# EAGLE design Stopwatch (EAGLE 9.5.2)
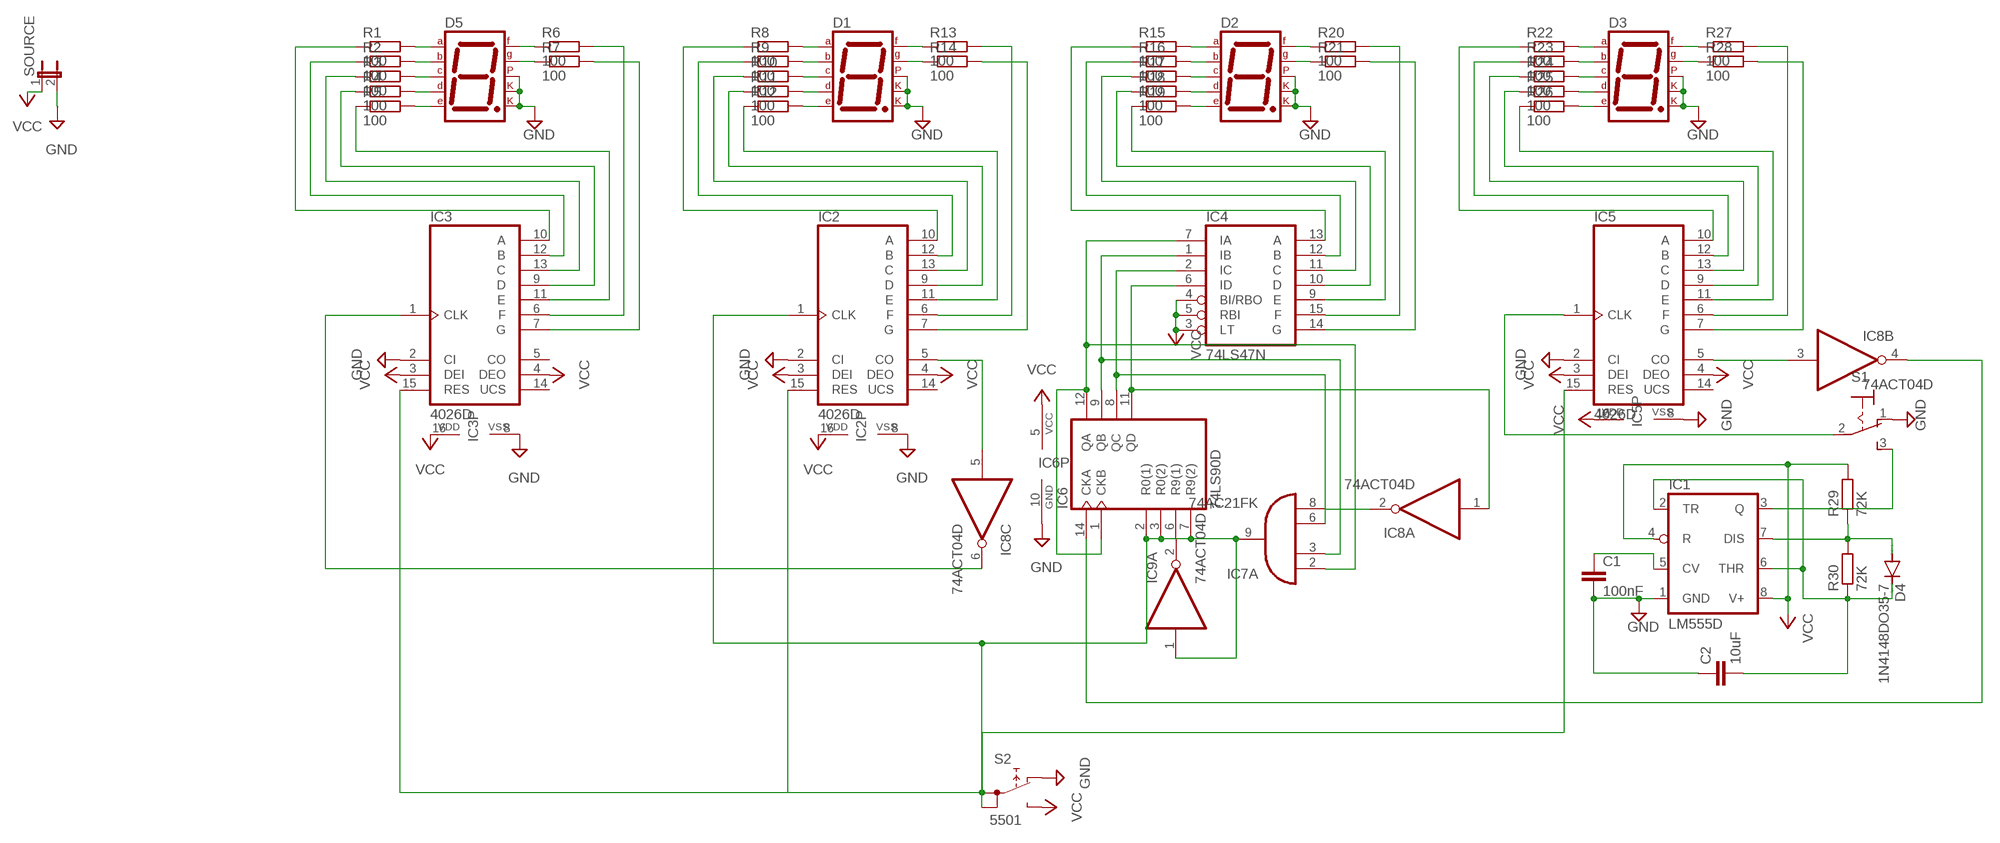
[diagram p0: schematic, sheet 1]

## Parts
C1  100nF  C2.5/2  [C2.5-2]
C2  10uF  C2.5/2  [C2.5-2]
D1  7SEG-CK  [7SEG-13]
D2  7SEG-CK  [7SEG-13]
D3  7SEG-CK  [7SEG-13]
D4  1N4148DO35-7  [DO35-7]
D5  7SEG-CK  [7SEG-13]
IC1  LM555D  [SO08]
IC2  4026D  [SO16]
IC3  4026D  [SO16]
IC4  74LS47N  [DIL16]
IC5  4026D  [SO16]
IC6  74LS90D  [SO14]
IC7  74AC21FK  [LCC20]
IC8  74ACT04D  [SO14]
IC9  74ACT04D  [SO14]
R1  100  R-EU_R0805  [R0805]
R2  100  R-EU_R0805  [R0805]
R3  100  R-EU_R0805  [R0805]
R4  100  R-EU_R0805  [R0805]
R5  100  R-EU_R0805  [R0805]
R6  100  R-EU_R0805  [R0805]
R7  100  R-EU_R0805  [R0805]
R8  100  R-EU_R0805  [R0805]
R9  100  R-EU_R0805  [R0805]
R10  100  R-EU_R0805  [R0805]
R11  100  R-EU_R0805  [R0805]
R12  100  R-EU_R0805  [R0805]
R13  100  R-EU_R0805  [R0805]
R14  100  R-EU_R0805  [R0805]
R15  100  R-EU_R0805  [R0805]
R16  100  R-EU_R0805  [R0805]
R17  100  R-EU_R0805  [R0805]
R18  100  R-EU_R0805  [R0805]
R19  100  R-EU_R0805  [R0805]
R20  100  R-EU_R0805  [R0805]
R21  100  R-EU_R0805  [R0805]
R22  100  R-EU_R0805  [R0805]
R23  100  R-EU_R0805  [R0805]
R24  100  R-EU_R0805  [R0805]
R25  100  R-EU_R0805  [R0805]
R26  100  R-EU_R0805  [R0805]
R27  100  R-EU_R0805  [R0805]
R28  100  R-EU_R0805  [R0805]
R29  72K  R-EU_R0805  [R0805]
R30  72K  R-EU_R0805  [R0805]
S1  320-916  [320-916]
S2  5501  [5501]
SOURCE  JP1E  [JP1]

## Nets
GND: C1.2 C2.1 D1.3(CK1) D1.5(DP) D1.8(CK2) D2.3(CK1) D2.5(DP) D2.8(CK2) D3.3(CK1) D3.5(DP) D3.8(CK2) D5.3(CK1) D5.5(DP) D5.8(CK2) IC1.1(GND) IC2.2(CI) IC2.8(VSS) IC3.2(CI) IC3.8(VSS) IC5.2(CI) IC5.8(VSS) IC6.10(GND) S1.1(O) S2.NC SOURCE.2
N$1: IC2.10(A) R8.1
N$2: IC2.12(B) R9.1
N$3: IC3.10(A) R1.1
N$4: IC3.12(B) R2.1
N$5: IC3.13(C) R3.1
N$6: IC3.9(D) R4.1
N$7: IC3.11(E) R5.1
N$8: IC3.6(F) R6.2
N$9: IC3.7(G) R7.2
N$10: D5.7(A) R1.2
N$11: D5.6(B) R2.2
N$12: D5.4(C) R3.2
N$13: D5.2(D) R4.2
N$14: D5.1(E) R5.2
N$15: D5.9(F) R6.1
N$16: D5.10(G) R7.1
N$17: IC2.13(C) R10.1
N$18: IC2.9(D) R11.1
N$19: IC2.11(E) R12.1
N$20: IC2.6(F) R13.2
N$21: IC2.7(G) R14.2
N$22: D1.7(A) R8.2
N$23: D1.6(B) R9.2
N$24: D1.4(C) R10.2
N$25: D1.2(D) R11.2
N$26: D1.1(E) R12.2
N$27: D1.9(F) R13.1
N$28: D1.10(G) R14.1
N$29: IC4.13(A) R15.1
N$30: IC4.12(B) R16.1
N$31: IC4.11(C) R17.1
N$32: IC4.10(D) R18.1
N$33: IC4.9(E) R19.1
N$34: IC4.15(F) R20.2
N$35: IC4.14(G) R21.2
N$36: D2.7(A) R15.2
N$37: D2.6(B) R16.2
N$38: D2.4(C) R17.2
N$39: D2.2(D) R18.2
N$40: D2.1(E) R19.2
N$41: D2.9(F) R20.1
N$42: D2.10(G) R21.1
N$43: IC5.10(A) R22.1
N$44: IC5.12(B) R23.1
N$45: IC5.13(C) R24.1
N$46: IC5.9(D) R25.1
N$47: IC5.11(E) R26.1
N$48: IC5.6(F) R27.2
N$49: IC5.7(G) R28.2
N$50: D3.7(A) R22.2
N$51: D3.6(B) R23.2
N$52: D3.4(C) R24.2
N$53: D3.2(D) R25.2
N$54: D3.1(E) R26.2
N$55: D3.9(F) R27.1
N$56: D3.10(G) R28.1
N$57: C1.1 IC1.5(CV)
N$58: IC5.1(CLK) S1.2(P)
N$59: C2.2 D4.C IC1.2(TR) IC1.6(THR) R30.1
N$60: D4.A IC1.7(DIS) R29.1 R30.2
N$62: IC4.7(IA) IC6.1(CKB) IC6.12(QA) IC7.2(A:I0)
N$63: IC4.1(IB) IC6.9(QB) IC7.3(A:I1)
N$64: IC4.2(IC) IC6.8(QC) IC7.6(A:I2)
N$65: IC4.6(ID) IC6.11(QD) IC8.1(A:I)
N$66: IC7.8(A:I3) IC8.2(A:O)
N$67: IC5.5(CO) IC8.3(B:I)
N$68: IC6.14(CKA) IC8.4(B:O)
N$70: IC2.5(CO) IC8.5(C:I)
N$71: IC3.1(CLK) IC8.6(C:O)
N$72: IC1.3(Q) S1.3(S)
N$73: IC6.6(R9(1)) IC9.2(A:O)
N$74: IC2.1(CLK) IC2.15(RES) IC3.15(RES) IC5.15(RES) IC6.2(R0(1)) IC6.3(R0(2)) IC6.7(R9(2)) IC7.9(A:O) IC9.1(A:I) S2.1A S2.1B
VCC: IC1.4(R) IC1.8(V+) IC2.3(DEI) IC2.4(DEO) IC2.16(VDD) IC3.3(DEI) IC3.4(DEO) IC3.16(VDD) IC4.3(LT) IC4.4(BI/RBO) IC4.5(RBI) IC5.3(DEI) IC5.4(DEO) IC5.16(VDD) IC6.5(VCC) R29.2 S2.NO SOURCE.1
Unconnected: IC2.14(UCS) IC3.5(CO) IC3.14(UCS) IC5.14(UCS) IC7.12(B:O) IC7.13(B:I0) IC7.14(B:I1) IC7.18(B:I2) IC7.19(B:I3) IC8.8(D:O) IC8.9(D:I) IC8.10(E:O) IC8.11(E:I) IC8.12(F:O) IC8.13(F:I) IC9.3(B:I) IC9.4(B:O) IC9.5(C:I) IC9.6(C:O) IC9.8(D:O) IC9.9(D:I) IC9.10(E:O) IC9.11(E:I) IC9.12(F:O) IC9.13(F:I)

## Power pins joined to a net without a drawn wire
GND: IC4.8(GND) IC7.10(P:GND) IC8.7(P:GND) IC9.7(P:GND)
VCC: IC4.16(VCC) IC7.20(P:VCC) IC8.14(P:VCC) IC9.14(P:VCC)

## Library data of the parts
C1 C2 = capacitor-wima:C: CAPACITOR naming: grid - package width
D1-D3 D5 = special:7SEG-CK: 7-segment DISPLAY single cathode, 13 mm
D4 = diode:1N4148: DIODE high speed (Philips)
IC1 = linear:*555: TIMER
IC2 IC3 IC5 = 40xx:4026: Decade COUNTER/DIVIDER, 7-seg. outputs
IC4 = 74xx-eu:74*47: BCD to seven segment DECODER/DRIVER Source: http://www.ee.washington.edu/stores/DataSheets/74ls/74ls47.pdf
IC6 = 74xx-us:74*90: Decade, divide by twelve and binary COUNTER
IC7 = 74xx-eu:74*21: Dual 4-input AND gate
IC8 IC9 = 74xx-eu:74*04: Hex INVERTER
R1-R30 = rcl:R-EU_: RESISTOR, European symbol; SPICEPREFIX: R
S1 = switch:320-916: TOGGLE SWITCH distributor RS Components
S2 = switch:55?: PUSHBUTTON SERIES 5500 SWITCHES Source: www.e-switch.com .. 5500.pdf
SOURCE = jumper:JP1E: JUMPER

## Board
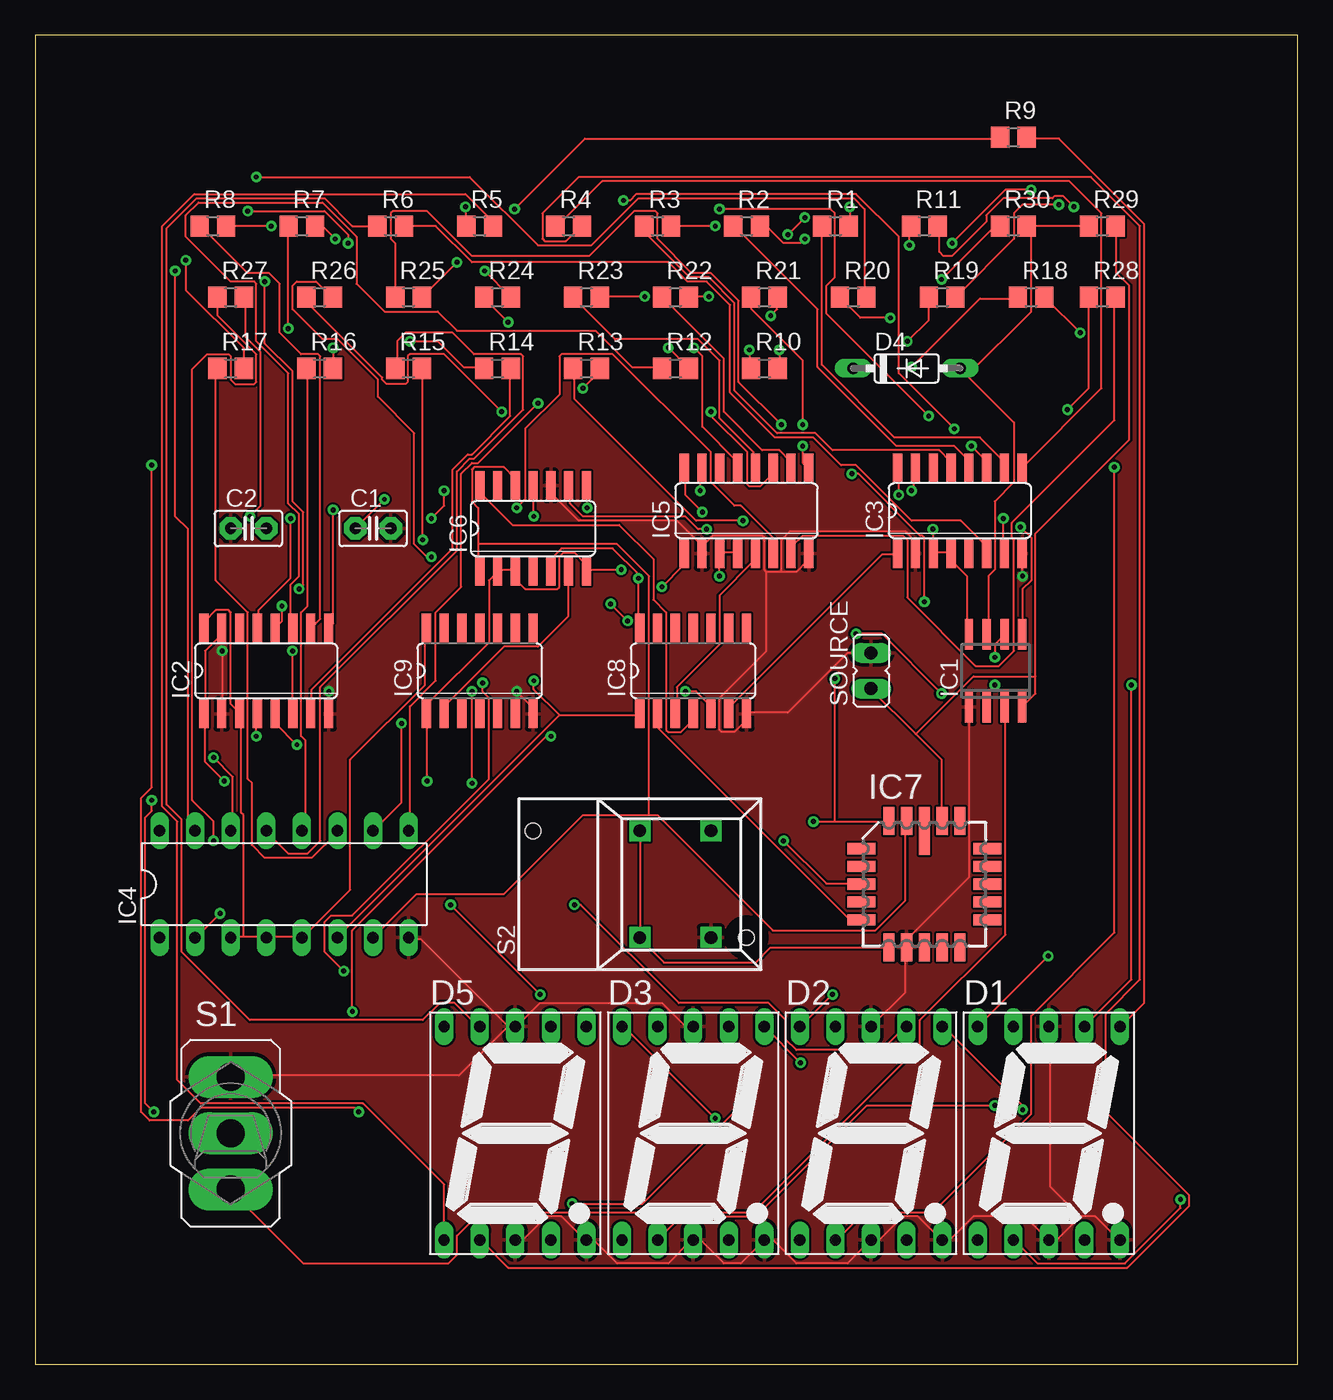
[diagram p1: board, top side]
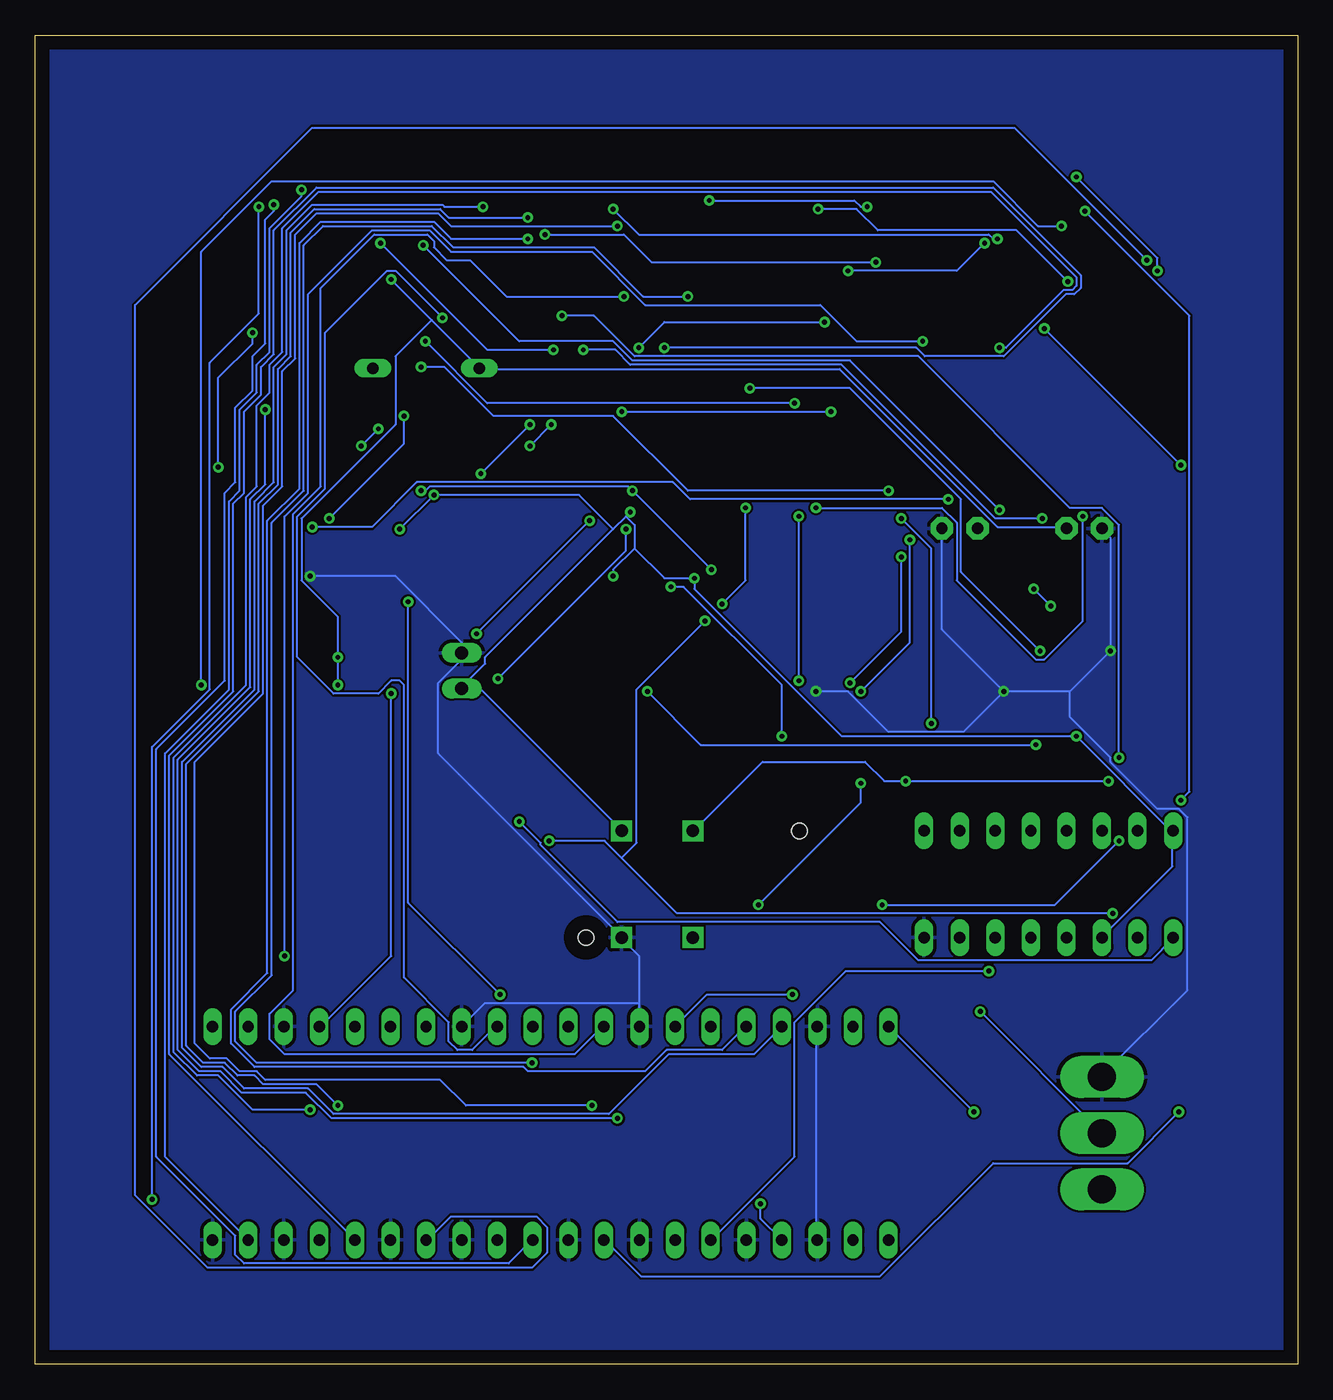
[diagram p2: board, bottom side, seen from below]

Size 90.15 x 94.92 mm. Coordinates in mm from the lower left corner, seen from the top.
Outline: 0,0 90.15,0 90.15,94.92 0,94.92 0,0
Copper layers (1*16): Top 0.035mm / dielectric 1.5mm / Bottom 0.035mm
Design rules "default": minimum track width 6mil, minimum drill 0.35mm, track to track 6mil, track to pad 6mil, pad to pad 6mil, via to via 6mil, smd to smd 6mil, copper to edge 40mil, drill to drill 6mil, minimum pad ring 10mil, minimum via ring 8mil, stop-mask expansion 4mil, vias tented up to drill 0mil, thermal gap 10mil

### Footprints (pad centres in the part's own frame; a part is rotated, then mirrored left to right if it is on the bottom)
C2.5-2 = drill 0.813 pad 1.6 octagon: 1 -1.27,0; 2 1.27,0
7SEG-13 = drill 0.813 long: 1 -5.08,-7.62; 2 -2.54,-7.62; 3 0,-7.62; 4 2.54,-7.62; 5 5.08,-7.62; 6 5.08,7.62; 7 2.54,7.62; 8 0,7.62; 9 -2.54,7.62; 10 -5.08,7.62
DO35-7 = drill 0.813 long: A 3.81,0; C -3.81,0
SO08 = smd 0.6 x 2.2: 1 -1.905,-2.6; 2 -0.635,-2.6; 3 0.635,-2.6; 4 1.905,-2.6; 5 1.905,2.6; 6 0.635,2.6; 7 -0.635,2.6; 8 -1.905,2.6
SO16 = smd 0.66 x 2.032: 1 -4.445,-3.073; 2 -3.175,-3.073; 3 -1.905,-3.073; 4 -0.635,-3.073; 5 0.635,-3.073; 6 1.905,-3.073; 7 3.175,-3.073; 8 4.445,-3.073; 9 4.445,3.073; 10 3.175,3.073; 11 1.905,3.073; 12 0.635,3.073; 13 -0.635,3.073; 14 -1.905,3.073; 15 -3.175,3.073; 16 -4.445,3.073
DIL16 = drill 0.813 long: 1 -8.89,-3.81; 2 -6.35,-3.81; 3 -3.81,-3.81; 4 -1.27,-3.81; 5 1.27,-3.81; 6 3.81,-3.81; 7 6.35,-3.81; 8 8.89,-3.81; 9 8.89,3.81; 10 6.35,3.81; 11 3.81,3.81; 12 1.27,3.81; 13 -1.27,3.81; 14 -3.81,3.81; 15 -6.35,3.81; 16 -8.89,3.81
SO14 = smd 0.66 x 2.032: 1 -3.81,-3.073; 2 -2.54,-3.073; 3 -1.27,-3.073; 4 0,-3.073; 5 1.27,-3.073; 6 2.54,-3.073; 7 3.81,-3.073; 8 3.81,3.073; 9 2.54,3.073; 10 1.27,3.073; 11 0,3.073; 12 -1.27,3.073; 13 -2.54,3.073; 14 -3.81,3.073
LCC20 = smd 0.8 x 3.4: 1 0,3.8 | smd 0.8 x 2: 2 -1.27,4.5; 3 -2.54,4.5; 9 -2.54,-4.5; 10 -1.27,-4.5; 11 0,-4.5; 12 1.27,-4.5; 13 2.54,-4.5; 19 2.54,4.5; 20 1.27,4.5 | smd 2 x 0.8: 4 -4.5,2.54; 5 -4.5,1.27; 6 -4.5,0; 7 -4.5,-1.27; 8 -4.5,-2.54; 14 4.5,-2.54; 15 4.5,-1.27; 16 4.5,0; 17 4.5,1.27; 18 4.5,2.54
R0805 = smd 1.3 x 1.5: 1 -0.95,0; 2 0.95,0
320-916 = drill 2.007 long: 1 0,4.013; 2 0,0; 3 0,-4.013
5501 = drill 0.9 pad 1.5 square: 1A 0,3.81; 1B 0,-3.81; NC 5.08,-3.81; NO 5.08,3.81 | hole 1.1: -7.62,3.81; 7.62,-3.81
JP1 = drill 0.914 long: 1 0,-1.27; 2 0,1.27

### Placement (x,y rotation side)
C1  24.13,59.69 0 top
C2  15.24,59.69 0 top
D1  72.39,16.51 0 top
D2  59.69,16.51 0 top
D3  46.99,16.51 0 top
D4  62.23,71.12 0 top
D5  34.29,16.51 0 top
IC1  68.58,49.53 0 top
IC2  16.51,49.53 0 top
IC3  66.04,60.96 0 top
IC4  17.78,34.29 0 top
IC5  50.8,60.96 0 top
IC6  35.56,59.69 0 top
IC7  63.5,34.29 0 top
IC8  46.99,49.53 0 top
IC9  31.75,49.53 0 top
R1  57.15,81.28 0 top
R2  50.8,81.28 0 top
R3  44.45,81.28 0 top
R4  38.1,81.28 0 top
R5  31.75,81.28 0 top
R6  25.4,81.28 0 top
R7  19.05,81.28 0 top
R8  12.7,81.28 0 top
R9  69.85,87.63 0 top
R10  52.07,71.12 0 top
R11  63.5,81.28 0 top
R12  45.72,71.12 0 top
R13  39.37,71.12 0 top
R14  33.02,71.12 0 top
R15  26.67,71.12 0 top
R16  20.32,71.12 0 top
R17  13.97,71.12 0 top
R18  71.12,76.2 0 top
R19  64.77,76.2 0 top
R20  58.42,76.2 0 top
R21  52.07,76.2 0 top
R22  45.72,76.2 0 top
R23  39.37,76.2 0 top
R24  33.02,76.2 0 top
R25  26.67,76.2 0 top
R26  20.32,76.2 0 top
R27  13.97,76.2 0 top
R28  76.2,76.2 0 top
R29  76.2,81.28 0 top
R30  69.85,81.28 0 top
S1  13.97,16.51 0 top
S2  43.18,34.29 0 top
SOURCE  59.69,49.53 0 top

### Tracks (layer width: path | path; a pad name or v marks a point on that pad's centre or on a via)
GND  (via drill 0.35)
  Top 0.152: D5.3 34.85,8.89 36.52,10.57 37.59,10.57 39.27,8.89 D5.5 39.88,8.89 41.55,7.21 45.21,7.21 46.89,8.89 D3.3 47.5,8.89 49.17,7.21 50.39,7.21 D3.5 52.68,8.89 54.36,7.21 58.01,7.21 D2.3 60.3,8.89 61.98,10.57 63.04,10.57 64.72,8.89 D2.5 65.33,8.89 67,10.57 70.66,10.57 72.34,8.89 D1.3 72.95,8.89 74.62,10.57 | 74.62,10.57 75.69,10.57 77.37,8.89 D1.5 | 74.62,10.57 72.49,12.7 72.49,24.13 D1.8 | 47.65,58.42 47.65,57.96 IC5.2 47.65,58.42 | 47.65,58.42 48.41,59.18 51.92,59.18 52.07,59.03 52.07,56.74 52.22,56.59 | 53.29,56.59 54.36,56.59 55.12,57.35 55.12,57.81 IC5.8 | 53.29,56.59 52.22,56.59 | 53.29,56.59 53.29,58.88 53.9,59.49 62.13,59.49 62.74,58.88 62.74,57.96 IC3.2 | IC6.10 36.83,62.23 38.81,60.25 45.82,60.25 47.65,58.42 | SOURCE.2 58.01,50.8 53.75,46.53 50.85,46.53 IC8.7 50.7,46.38 50.7,45.92 49.94,45.16 49.02,45.16 48.87,45.31 48.87,47.6 52.22,50.95 52.22,56.59 | v70.51,56.29 70.51,57.81 IC3.8 | D2.8 62.13,26.57 62.13,29.77 IC7.10 62.28,29.92 62.28,30.38 66.7,34.8 66.7,46.84 IC1.1 | v13.36,50.95 13.36,46.53 IC2.2 | v20.98,48.06 20.98,46.53 IC2.8 | v34.39,48.06 35.46,46.99 35.46,46.53 IC9.7 | 33.78,24.13 D5.8 | 33.78,24.13 27.53,30.38 26.77,30.38 IC4.8 | 33.78,24.13 30.28,20.62 13.97,20.62 S1.1 | 34.24,24.13 D5.8 | D3.8 46.43,24.13 44.76,25.81 36.07,25.81 34.39,24.13 D5.8
  Bottom 0.152: v70.51,56.29 64.41,56.29 59.69,51.56 SOURCE.2 59.69,50.34 61.37,48.67 61.37,43.64 48.26,30.53 S2.NC 48.26,30.38 47.04,29.16 47.04,25.81 | 47.04,25.81 47.04,24.13 D3.8 | 47.04,25.81 58.01,25.81 D2.8 | C2.1 13.97,59.64 13.36,59.03 v13.36,50.95 16.26,48.06 | 16.26,48.06 v20.98,48.06 | v34.39,48.06 32.11,48.06 29.21,45.16 23.88,45.16 v20.98,48.06 | C1.2 25.4,52.48 v20.98,48.06 | 16.26,48.06 16.26,46.23 13.36,43.33 13.36,43.03 10.01,39.67 8.48,39.67 7.87,39.06 7.87,26.72 13.97,20.62 S1.1 | D5.3 34.39,8.89 34.39,24.13 D5.8
  pour Top: 0,96.52 91.44,96.52 91.44,-1.27 0,-1.27
  pour Bottom: -1.27,97.79 91.44,97.79 92.71,97.79 92.71,-1.27 92.71,-2.54 -2.54,-2.54 -2.54,97.79
N$1
  Top 0.152: R8.1 11.84,81.28 15.19,77.93 16.71,77.93 17.48,77.16 17.48,73.66 19,72.14 20.22,72.14 20.37,71.98 20.37,53.24 19.76,52.63 IC2.10
N$2  (via drill 0.35)
  Top 0.152: v34.24,82.5 39.27,87.53 68.83,87.53 R9.1 | v16.41,77.32 16.41,72.9 18.39,70.92 18.39,61.62 19.15,60.86 19.15,55.68 v18.85,55.37 | v17.63,54.15 17.63,53.09 IC2.12
  Bottom 0.152: v34.24,82.5 31.5,82.5 29.97,80.97 20.07,80.97 v16.41,77.32 | v17.63,54.15 v18.85,55.37
N$3
  Top 0.152: R1.1 56.19,81.28 56.19,71.37 61.37,66.19 67.46,66.19 69.14,64.52 69.14,64.06 IC3.10
N$4
  Top 0.152: R2.1 49.94,81.28 55.88,75.34 55.88,71.22 61.52,65.58 65.63,65.58 66.55,64.67 66.55,64.06 IC3.12
N$5
  Top 0.152: R3.1 43.54,81.28 43.54,80.82 46.74,77.62 48.11,77.62 49.94,75.79 49.94,69.55 52.98,66.5 55.73,66.5 56.95,65.28 64.57,65.28 65.33,64.52 65.33,64.06 IC3.13
N$6
  Top 0.152: IC3.9 76.15,69.7 76.15,82.19 73.86,84.48 40.49,84.48 37.29,81.28 R4.1
N$7  (via drill 0.35)
  Top 0.152: v30.73,82.65 30.73,81.28 R5.1 | v42.01,83.11 42.47,83.11 42.93,83.57 58.62,83.57 61.67,80.52 61.67,70.76 v65.63,66.8 | v66.85,65.58 67.92,64.52 67.92,64.06 IC3.11
  Bottom 0.152: v30.73,82.65 31.19,82.65 31.65,83.11 v42.01,83.11 | v66.85,65.58 v65.63,66.8
N$8
  Top 0.152: R6.2 28.6,81.28 31.19,78.69 45.21,78.69 46.58,77.32 47.95,77.32 49.63,75.64 49.63,69.39 52.83,66.19 55.58,66.19 57.56,64.21 58.62,64.21 62.59,60.25 66.09,60.25 67.92,58.42 67.92,57.96 IC3.6
N$9  (via drill 0.35)
  Top 0.152: R7.2 20.52,81.28 v21.44,80.37 | v48.87,82.5 56.79,82.5 57.1,82.19 57.1,77.62 56.49,77.01 56.49,75.03 v63.8,67.72 | v69.14,60.4 69.14,57.96 IC3.7
  Bottom 0.152: v21.44,80.37 21.74,80.37 22.05,80.67 47.04,80.67 v48.87,82.5 | v63.8,67.72 63.8,65.73 v69.14,60.4
N$10  (via drill 0.35)
  Top 0.152: v58.17,82.65 58.17,81.28 R1.2
  Bottom 0.152: v58.17,82.65 60.91,82.65 61.06,82.8 70.36,82.8 72.19,80.97 72.19,72.14 73.1,71.22 73.1,62.99 74.47,61.62 74.47,48.21 79.65,43.03 79.65,22.61 78.28,21.23 76.76,21.23 75.23,19.71 70.66,19.71 68.83,17.88 49.17,17.88 44.91,22.15 38.81,22.15 D5.7
N$11  (via drill 0.35)
  Top 0.152: R2.2 52.22,81.28 53.44,80.06 54.66,80.06 v54.97,80.37
  Bottom 0.152: v54.97,80.37 60.45,80.37 61.67,81.58 69.75,81.58 71.27,80.06 71.27,62.53 73.56,60.25 73.56,27.94 76.15,25.35 76.15,22.91 74.47,21.23 55.27,21.23 54.97,20.93 46.58,20.93 45.06,22.45 41.1,22.45 39.42,24.13 D5.6
N$12  (via drill 0.35)
  Top 0.152: v48.57,81.28 R3.2 | v50.39,18.49 43.38,11.48 v38.35,11.48
  Bottom 0.152: v48.57,81.28 60.45,81.28 61.37,82.19 70.05,82.19 71.58,80.67 71.58,71.83 72.49,70.92 72.49,62.69 73.86,61.32 73.86,47.9 78.74,43.03 78.74,22.91 77.67,21.84 76.45,21.84 75.54,20.93 74.32,20.93 73.71,20.32 61.21,20.32 59.38,18.49 v50.39,18.49 | v38.35,11.48 38.35,10.41 D5.4
N$13
  Top 0.152: R4.2 38.96,81.28 37.9,80.21 36.37,80.21 36.22,80.37 36.22,82.19 38.81,84.78 75.39,84.78 78.89,81.28 78.89,27.48 76.45,25.04 76.45,18.03 82.4,12.09 82.4,11.33 77.98,6.91 33.78,6.91 31.8,8.89 D5.2
N$14
  Top 0.152: D5.1 29.21,12.85 23.42,18.64 11.84,18.64 10.16,20.32 10.16,38.76 9.09,39.83 9.09,81.28 11.38,83.57 30.73,83.57 32.56,81.74 32.56,81.28 R5.2
N$15
  Top 0.152: R6.1 22.66,81.28 20.68,83.26 11.53,83.26 9.4,81.13 9.4,39.98 10.46,38.91 10.46,29.46 15.34,24.59 27.69,24.59 28.91,25.81 29.97,25.81 31.65,24.13 D5.9
N$16  (via drill 0.35)
  Top 0.152: v18.09,73.97 18.09,81.28 R7.1 | v8.33,64.21 8.33,41.2 7.57,40.44 7.57,18.03 8.18,17.42 10.92,17.42 11.84,18.34 22.81,18.34 v23.11,18.03
  Bottom 0.152: v8.33,64.21 v18.09,73.97 | D5.10 v23.11,18.03
N$17  (via drill 0.35)
  Top 0.152: v51,72.44 51,71.22 R10.1 | v18.24,60.4 18.24,56.13 15.95,53.85 15.95,52.63 IC2.13
  Bottom 0.152: v51,72.44 48.72,72.44 47.65,71.37 32.56,71.37 21.59,60.4 v18.24,60.4
N$18  (via drill 0.35)
  Top 0.152: v62.43,79.91 62.43,81.28 R11.1 | v21.29,61.01 21.29,52.93 IC2.9
  Bottom 0.152: v62.43,79.91 55.58,73.05 48.87,73.05 47.5,71.68 31.95,71.68 v21.29,61.01
N$19
  Top 0.152: IC2.11 18.24,52.78 18.24,55.68 18.85,56.29 18.85,60.71 18.09,61.47 18.09,70.76 15.8,73.05 15.8,77.16 15.65,77.32 13.97,77.32 10.77,80.52 10.77,82.04 11.68,82.96 20.52,82.96 22.96,80.52 22.96,77.16 24.94,75.18 28.75,75.18 30.12,73.81 40.03,73.81 42.62,71.22 44.76,71.22 R12.1
N$20  (via drill 0.35)
  Top 0.152: v39.12,69.7 40.18,70.76 40.18,71.07 R13.2 | v18.39,50.95 18.39,46.53 IC2.6
  Bottom 0.152: v39.12,69.7 31.95,69.7 24.03,61.77 24.03,56.59 v18.39,50.95
N$21
  Top 0.152: R14.2 33.93,71.07 33.93,67.72 31.19,64.97 30.89,64.97 29.82,63.91 29.82,58.27 19.76,48.21 19.76,46.53 IC2.7
N$22  (via drill 0.35)
  Top 0.152: v16.87,81.28 R8.2 | v78.28,48.51 78.28,27.48 D1.7
  Bottom 0.152: v16.87,81.28 18.54,81.28 21.74,84.48 73.25,84.48 78.28,79.45 v78.28,48.51
N$23
  Top 0.152: R9.2 70.81,87.53 73.1,87.53 79.2,81.43 79.2,25.81 77.52,24.13 D1.6
N$24  (via drill 0.35)
  Top 0.152: v53.14,72.44 53.14,71.22 R10.2 | v65.48,80.06 69.29,83.87 v71.12,83.87
  Bottom 0.152: v53.14,72.44 57.86,72.44 v65.48,80.06 | v71.12,83.87 71.12,83.41 73.41,81.13 73.41,72.29 74.32,71.37 74.32,69.39 75.54,68.17 75.54,62.38 76.3,61.62 76.3,48.21 80.87,43.64 80.87,14.83 D1.4
N$25  (via drill 0.35)
  Top 0.152: v74.17,82.65 73.41,83.41 72.8,83.41 72.64,83.26 69.14,83.26 67.92,82.04 67.92,81.58 65.48,79.15 64.87,79.15 64.57,79.45 64.57,81.28 R11.2 | v81.79,11.79 81.79,11.18 77.83,7.21 71.58,7.21 69.9,8.89 D1.2
  Bottom 0.152: v74.17,82.65 74.17,75.03 77.67,71.53 77.67,48.21 81.79,44.09 v81.79,11.79
N$26  (via drill 0.35)
  Top 0.152: v45.21,72.59 46.58,71.22 R12.2
  Bottom 0.152: v45.21,72.59 27.23,72.59 26.62,71.98 20.98,71.98 16.56,76.4 15.95,76.4 15.49,76.86 15.49,77.77 21.74,84.02 70.05,84.02 73.1,80.97 73.1,72.14 74.02,71.22 74.02,69.24 75.23,68.02 75.23,62.23 76,61.47 76,48.06 80.57,43.48 80.57,22.15 D1.1
N$27  (via drill 0.35)
  Top 0.152: v50.55,60.25 47.19,60.25 38.51,68.94 38.51,71.07 R13.1 | v58.62,52.17 60.45,52.17 v64.72,47.9
  Bottom 0.152: v58.62,52.17 v50.55,60.25 | v64.72,47.9 64.72,29.16 69.75,24.13 D1.9
N$28  (via drill 0.35)
  Top 0.152: v26.77,73.05 28.75,73.05 30.58,71.22 31.95,71.22 R14.1 | D1.10 v72.34,29.16
  Bottom 0.152: v26.77,73.05 31.5,73.05 34.09,75.64 46.58,75.64 50.39,79.45 60.45,79.45 61.98,80.97 66.09,80.97 70.66,76.4 70.66,62.23 72.34,60.55 v72.34,29.16
N$29
  Top 0.152: R15.1 25.86,71.22 25.86,73.05 26.47,73.66 29.82,73.66 31.34,72.14 34.7,72.14 34.85,71.98 34.85,68.17 31.34,64.67 31.04,64.67 30.12,63.75 30.12,58.11 20.37,48.36 20.37,37.39 19.46,36.47 18.09,36.47 16.56,38 IC4.13
N$30
  Top 0.152: R16.1 19.46,71.07 19.46,54.15 19,53.7 19,44.86 19.3,44.55 19.3,38.3 19.15,38.15 IC4.12
N$31
  Top 0.152: R17.1 12.9,71.07 12.9,55.98 15.19,53.7 15.19,41.81 15.49,41.5 15.49,37.08 16.41,36.17 19.76,36.17 21.59,38 IC4.11
N$32  (via drill 0.35)
  Top 0.152: v62.59,71.22 67.46,76.1 70.05,76.1 R18.1 | v29.21,62.38 29.21,61.32 v28.3,60.4 | v26.16,45.77 26.16,40.13 IC4.10
  Bottom 0.152: v62.59,71.22 60.91,71.22 57.4,67.72 48.87,67.72 43.54,62.38 v29.21,62.38 | v28.3,60.4 26.16,58.27 v26.16,45.77
N$33  (via drill 0.35)
  Top 0.152: v62.28,73.05 63.8,74.57 63.8,76.1 R19.1 | v35.92,68.63 31.65,64.36 31.19,64.36 30.43,63.6 30.43,55.52 28.6,53.7 28.6,48.82 26.77,46.99 26.77,38.15 IC4.9
  Bottom 0.152: v62.28,73.05 57.86,68.63 v35.92,68.63
N$34  (via drill 0.35)
  Top 0.152: v15.8,84.78 31.04,84.78 35.92,79.91 39.73,79.91 43.08,83.26 58.47,83.26 59.23,82.5 59.23,76.25 R20.2 | v10.01,78.08 10.01,60.55 10.92,59.64 10.92,38.61 IC4.15
  Bottom 0.152: v15.8,84.78 10.01,78.99 v10.01,78.08
N$35  (via drill 0.35)
  Top 0.152: v52.53,74.88 52.98,75.34 52.98,76.1 R21.2 | v12.75,43.33 14.12,41.96 14.12,38.3 13.97,38.15 IC4.14
  Bottom 0.152: v52.53,74.88 50.24,74.88 47.35,71.98 27.08,71.98 16.26,61.16 13.97,61.16 12.75,59.94 v12.75,43.33
N$36  (via drill 0.35)
  Top 0.152: v27.69,58.88 27.69,71.07 R15.2 | v31.19,41.5 v31.19,48.06 | v38.51,32.82 38.96,32.82 45.97,25.81 52.38,25.81 53.59,24.59 53.59,23.22 54.36,22.45 60.45,22.45 62.13,24.13 D2.7
  Bottom 0.152: v27.69,58.88 27.69,51.56 v31.19,48.06 | v31.19,41.5 31.19,40.13 v38.51,32.82
N$37  (via drill 0.35)
  Top 0.152: v21.29,72.59 21.29,71.22 R16.2 | v70.51,18.19 70.51,18.49 64.87,24.13 D2.6
  Bottom 0.152: v21.29,72.59 20.83,72.59 16.71,76.71 16.1,76.71 15.8,77.01 15.8,77.62 21.89,83.72 69.9,83.72 72.49,81.13 72.49,72.29 73.41,71.37 73.41,69.39 74.32,68.48 74.32,62.69 75.08,61.92 75.08,48.51 80.26,43.33 80.26,22.3 78.59,20.62 77.06,20.62 74.62,18.19 v70.51,18.19
N$38  (via drill 0.35)
  Top 0.152: v10.77,78.84 10.77,76.71 14.88,72.59 14.88,71.22 R17.2
  Bottom 0.152: v10.77,78.84 20.22,88.29 70.36,88.29 83.01,75.64 83.01,12.09 77.83,6.91 54.66,6.91 53.59,7.98 53.59,9.8 54.36,10.57 60.45,10.57 62.13,8.89 D2.4
N$39  (via drill 0.35)
  Top 0.152: v74.62,73.66 72.19,76.1 R18.2 | v77.06,64.06 77.06,30.84 71.12,24.89 71.12,17.88 64.11,10.87 59.23,10.87 57.25,8.89 D2.2
  Bottom 0.152: v74.62,73.66 74.62,72.9 77.06,70.46 v77.06,64.06
N$40  (via drill 0.35)
  Top 0.152: v73.1,82.8 70.51,82.8 69.9,82.19 69.9,80.37 65.79,76.25 R19.2
  Bottom 0.152: v73.1,82.8 73.1,82.35 73.71,81.74 73.71,72.9 74.62,71.98 74.62,69.55 75.84,68.33 75.84,62.99 76.61,62.23 76.61,48.82 81.48,43.94 81.48,14.83 75.84,9.2 75.84,7.82 75.23,7.21 56.34,7.21 54.66,8.89 D2.1
N$41  (via drill 0.35)
  Top 0.152: v61.06,74.73 58.93,74.73 57.56,76.1 R20.1
  Bottom 0.152: v61.06,74.73 64.41,78.08 65.02,78.08 69.44,73.66 69.44,62.53 71.42,60.55 71.42,50.49 68.83,47.9 65.63,47.9 64.72,48.82 64.11,48.82 63.8,48.51 63.8,27.63 60.6,24.44 60.6,23.06 60,22.45 58.93,22.45 57.25,24.13 D2.9
N$42  (via drill 0.35)
  Top 0.152: v54.81,67.11 54.81,71.68 51.16,75.34 51.16,76.1 R21.1 | v58.32,63.6 58.78,63.6 63.2,59.18 63.35,59.18 63.5,59.03 v63.5,54.46 | v56.95,26.42 54.66,24.13 D2.10
  Bottom 0.152: v58.32,63.6 v54.81,67.11 | v63.5,54.46 63.5,32.97 v56.95,26.42
N$43
  Top 0.152: R22.1 44.91,76.1 49.17,71.83 49.17,68.02 51.92,65.28 53.14,65.28 53.9,64.52 53.9,64.06 IC5.10
N$44
  Top 0.152: R23.1 38.51,76.1 41.4,73.2 47.35,73.2 48.87,71.68 48.87,67.56 51.31,65.13 51.31,64.06 IC5.12
N$45  (via drill 0.35)
  Top 0.152: v33.78,74.42 32.11,76.1 R24.1 | v47.04,72.59 47.65,71.98 47.65,66.95 50.09,64.52 50.09,64.06 IC5.13
  Bottom 0.152: v33.78,74.42 45.21,74.42 v47.04,72.59
N$46  (via drill 0.35)
  Top 0.152: v53.29,67.11 50.24,70.16 50.24,75.95 48.26,77.93 46.89,77.93 44.45,80.37 44.45,82.19 44.3,82.35 42.77,82.35 39.57,79.15 31.19,79.15 27.99,82.35 25.55,82.35 25.4,82.19 25.4,80.37 25.7,80.06 25.7,76.25 R25.1 | v54.81,65.58 54.81,64.36 55.12,64.06 IC5.9
  Bottom 0.152: v54.81,65.58 v53.29,67.11
N$47  (via drill 0.35)
  Top 0.152: v33.33,68.02 29.21,72.14 26.77,72.14 26.62,71.98 26.62,70.16 26.47,70 25.09,70 24.79,70.31 24.79,70.46 19.46,75.79 19.46,76.1 R26.1 | v48.26,68.02 48.26,67.72 50.85,65.13 50.85,62.84 51,62.69 51.77,62.69 52.68,63.6 52.68,63.91 IC5.11
  Bottom 0.152: v48.26,68.02 v33.33,68.02
N$48  (via drill 0.35)
  Top 0.152: v15.34,60.55 16.1,61.32 16.1,72.29 15.04,73.36 15.04,76.1 R27.2 | v34.39,61.16 35,61.77 35,66.8 37.44,69.24 37.44,71.98 37.59,72.14 41.25,72.14 48.26,65.13 48.26,62.99 49.94,61.32 50.39,61.32 52.68,59.03 52.68,57.96 IC5.6
  Bottom 0.152: v15.34,60.55 15.34,53.09 18.09,50.34 18.69,50.34 24.33,55.98 24.33,60.1 25.4,61.16 v34.39,61.16
N$49
  Top 0.152: R28.2 77.06,76.1 77.06,67.41 69.75,60.1 69.75,59.03 69.9,58.88 69.9,50.95 68.83,49.89 67.16,49.89 62.28,54.76 62.28,58.88 61.98,59.18 54.81,59.18 54.05,58.42 54.05,57.96 IC5.7
N$50  (via drill 0.35)
  Top 0.152: v48.11,76.25 46.74,76.25 R22.2
  Bottom 0.152: v48.11,76.25 56.49,76.25 59.08,78.84 60.76,78.84 61.67,79.76 61.67,80.21 62.13,80.67 65.94,80.67 69.75,76.86 69.75,62.69 71.73,60.71 71.73,26.72 73.41,25.04 73.41,23.22 72.34,22.15 51.61,22.15 49.63,24.13 D3.7
N$51  (via drill 0.35)
  Top 0.152: v43.54,76.25 40.34,76.25 R23.2 | D3.6 v54.66,21.54
  Bottom 0.152: v43.54,76.25 46.74,76.25 50.24,79.76 60.3,79.76 61.82,81.28 69.6,81.28 70.97,79.91 70.97,62.38 73.25,60.1 73.25,27.79 75.84,25.2 75.84,23.06 74.32,21.54 v54.66,21.54
N$52  (via drill 0.35)
  Top 0.152: v32.11,78.08 33.93,76.25 R24.2 | v22.35,80.06 22.35,80.67 20.68,82.35 v15.19,82.35 | v8.33,40.28 8.33,39.52 7.87,39.06 7.87,18.64 v8.48,18.03
  Bottom 0.152: v32.11,78.08 24.33,78.08 v22.35,80.06 | v15.19,82.35 7.72,74.88 7.72,40.89 v8.33,40.28 | v8.48,18.03 12.14,14.38 21.74,14.38 29.82,6.3 46.89,6.3 49.48,8.89 D3.4
N$53  (via drill 0.35)
  Top 0.152: v30.12,78.69 27.69,76.25 R25.2 | v54.97,81.89 v53.75,80.67 | v68.53,18.49 59.38,18.49 51.46,10.57 46.13,10.57 D3.2
  Bottom 0.152: v30.12,78.69 46.13,78.69 48.11,80.67 v53.75,80.67 | v54.97,81.89 60.6,81.89 61.21,82.5 70.21,82.5 71.88,80.82 71.88,71.98 72.8,71.07 72.8,62.84 74.17,61.47 74.17,48.06 79.35,42.88 79.35,22.76 78.13,21.54 76.61,21.54 75.69,20.62 74.47,20.62 73.86,20.02 70.05,20.02 v68.53,18.49
N$54  (via drill 0.35)
  Top 0.152: v28.3,57.66 27.99,57.66 27.08,58.57 27.08,66.5 24.49,69.09 24.49,70.31 21.59,73.2 20.52,73.2 18.39,75.34 18.39,77.01 18.69,77.32 20.07,77.32 21.13,76.25 R26.2 | v31.95,48.67 31.95,48.06 32.41,47.6 32.41,41.81 22.66,32.05 21.13,32.05 20.68,31.6 20.68,29.46 v22.05,28.09
  Bottom 0.152: v28.3,57.66 28.3,52.32 v31.95,48.67 | v22.05,28.09 32.26,28.09 35.92,24.44 35.92,14.83 41.86,8.89 D3.1
N$55  (via drill 0.35)
  Top 0.152: v12.75,37.39 12.75,38.76 11.23,40.28 11.23,71.07 12.29,72.14 13.82,72.14 13.97,71.98 13.97,70.31 14.27,70 15.65,70 15.8,70.16 15.8,72.14 13.06,74.88 13.06,76.1 R27.1 | v36.07,26.42 v29.67,32.82
  Bottom 0.152: v12.75,37.39 17.32,32.82 v29.67,32.82 | v36.07,26.42 42.16,26.42 D3.9
N$56  (via drill 0.35)
  Top 0.152: v73.71,68.17 75.23,69.7 75.23,76.1 R28.1 | v48.57,17.58 42.01,24.13 D3.10
  Bottom 0.152: v73.71,68.17 73.71,62.84 74.78,61.77 74.78,48.36 79.96,43.18 79.96,22.45 78.43,20.93 76.91,20.93 75.39,19.41 70.81,19.41 68.99,17.58 v48.57,17.58
N$57  (via drill 0.35)
  Top 0.152: v70.36,59.79 71.12,59.03 71.12,55.98 70.51,55.37 70.51,52.17 IC1.5 | C1.1 v24.94,61.77
  Bottom 0.152: v70.36,59.79 66.09,59.79 62.89,62.99 44.6,62.99 43.38,61.77 v24.94,61.77
N$58  (via drill 0.35)
  Top 0.152: v44.76,55.52 46.28,57.05 46.28,57.81 IC5.1 | v36.83,44.86 36.52,44.86 22.66,30.99 v22.66,25.2
  Bottom 0.152: v44.76,55.52 43.84,55.52 36.83,48.51 v36.83,44.86 | S1.2 v22.66,25.2
N$59  (via drill 0.35)
  Top 0.152: v68.53,48.51 68.07,48.06 68.07,46.99 IC1.2 | v68.53,50.49 68.53,51.41 69.14,52.02 IC1.6 | R30.1 68.53,81.28 v64.72,77.47
  Bottom 0.152: v68.53,48.51 v68.53,50.49 68.53,53.39 71.12,55.98 71.12,60.4 64.41,67.11 64.41,71.98 61.82,74.57 | 61.82,74.57 58.47,71.22 D4.C 58.32,71.07 32.71,71.07 21.44,59.79 16.56,59.79 C2.2 | 61.82,74.57 v64.72,77.47
N$60
  Top 0.152: R29.1 71.12,81.28 | 71.12,81.28 R30.2 70.81,81.28 | 66.55,70.61 D4.A 66.09,71.07 | 66.55,70.61 69.9,67.26 69.9,62.99 68.53,61.62 68.53,56.74 68.07,56.29 68.07,52.17 IC1.7 | 71.12,81.28 71.12,75.18 66.55,70.61
N$62
  Top 0.152: 31.65,58.57 31.65,61.16 31.19,61.62 31.19,63.91 31.34,64.06 33.48,64.06 34.24,63.3 34.24,62.84 IC6.12 | 31.65,58.57 31.65,56.74 IC6.1 | 43.84,39.22 39.12,39.22 33.48,33.58 27.23,33.58 IC4.7 | 43.84,39.22 44.45,39.22 52.68,30.99 60,30.99 62.13,33.12 62.13,38.76 IC7.2 | 31.65,58.57 41.55,58.57 43.84,56.29 43.84,39.22
N$63  (via drill 0.35)
  Top 0.152: v55.58,38.76 57.1,38.76 | 57.1,38.76 60.91,38.76 IC7.3 | v47.95,59.64 47.35,59.64 46.43,60.55 39.12,60.55 38.2,61.47 38.2,62.69 IC6.9 | 57.1,38.76 v57.1,48.97
  Bottom 0.152: v55.58,38.76 54.05,37.24 54.05,37.08 48.57,31.6 29.82,31.6 27.08,28.85 10.46,28.85 8.94,30.38 IC4.1 | v47.95,59.64 47.95,58.11 v57.1,48.97
N$64  (via drill 0.35)
  Top 0.152: v53.44,37.39 56.49,34.34 58.93,34.34 IC7.6 | v13.21,32.21 11.53,30.53 IC4.2 | v39.42,61.16 39.42,62.69 IC6.8 | v42.32,53.09 v41.1,54.3
  Bottom 0.152: v53.44,37.39 49.48,37.39 48.26,36.17 | 48.26,36.17 44.3,32.21 v13.21,32.21 | v39.42,61.16 39.42,55.98 v41.1,54.3 | v42.32,53.09 47.19,48.21 47.19,37.24 48.26,36.17
N$65  (via drill 0.35)
  Top 0.152: 37.44,46.38 43.08,46.38 IC8.1 | 37.44,46.38 21.59,30.53 IC4.6 | v35.61,60.55 35.61,62.69 IC6.11 | v35.61,48.82 35.61,48.21 37.44,46.38
  Bottom 0.152: v35.61,48.82 v35.61,60.55
N$66
  Top 0.152: IC7.8 58.17,31.75 44.45,45.47 IC8.2
N$67
  Top 0.152: IC8.3 45.82,46.53 45.82,48.36 48.87,51.41 48.87,54.91 51.31,57.35 51.31,57.81 IC5.5
N$68
  Top 0.152: IC8.4 46.89,46.38 46.89,45.92 46.13,45.16 45.21,45.16 45.06,45.31 45.06,53.7 44.15,54.61 44.15,57.51 41.71,59.94 34.09,59.94 31.8,62.23 31.8,62.69 IC6.14
N$70  (via drill 0.35)
  Top 0.152: v18.69,44.25 17.17,45.77 17.17,46.38 IC2.5 | v46.43,48.06 47.19,48.06 48.26,46.99 IC8.5
  Bottom 0.152: v18.69,44.25 42.62,44.25 v46.43,48.06
N$71
  Top 0.152: IC8.6 49.63,46.53 49.63,46.99 60.45,57.81 61.52,57.81 IC3.1
N$72
  Top 0.152: IC1.3 69.29,46.84 69.29,30.68 63.2,24.59 63.2,22.76 51.31,10.87 31.8,10.87 30.12,9.2 30.12,7.82 29.52,7.21 19.15,7.21 13.97,12.39 S1.3
N$73
  Top 0.152: IC9.2 29.21,46.99 33.48,51.26 35.92,51.26 38.05,53.39 38.05,56.59 IC6.6
N$74  (via drill 0.35)
  Top 0.152: v47.5,62.38 47.5,63.91 IC5.15 | v41.86,56.74 39.42,56.74 IC6.7 39.27,56.74 39.27,57.2 38.51,57.96 37.74,57.96 37.44,57.66 37.44,55.52 37.29,55.37 35,55.37 34.39,55.98 34.39,56.59 IC6.3 34.24,56.74 33.02,56.74 IC6.2 33.02,56.59 32.41,55.98 32.41,51.56 27.99,47.14 27.99,46.53 IC9.1 27.99,46.38 v27.99,41.66 | v62.59,62.38 62.74,62.53 62.74,63.91 IC3.15 | IC2.15 13.21,52.48 13.21,52.02 12.14,50.95 12.14,46.53 IC2.1 12.14,46.38 12.14,43.03 v13.51,41.66 | IC7.9 60.91,29.77 52.53,29.77 51.46,28.7 44.91,28.7 43.23,30.38 S2.1B 43.23,30.53 43.23,38 S2.1A
  Bottom 0.152: v41.86,56.74 v47.5,62.38 47.8,62.69 61.98,62.69 62.28,62.38 v62.59,62.38 | v13.51,41.66 v27.99,41.66 29.52,41.66 30.89,43.03 38.2,43.03 43.08,38.15 S2.1A
VCC  (via drill 0.35)
  Top 0.152: v15.8,44.86 15.8,46.38 IC2.4 | IC2.16 12.14,52.63 12.14,53.09 12.9,53.85 13.82,53.85 13.97,53.7 13.97,47.14 14.58,46.53 IC2.3 14.73,46.38 14.73,39.37 14.88,39.22 14.88,30.53 | 14.88,30.53 16.41,30.53 IC4.4 16.56,30.53 19,30.53 IC4.5 19.15,30.53 22.5,33.88 22.5,43.18 27.84,48.51 27.84,52.48 IC9.14 | 14.88,30.53 13.97,30.53 IC4.3 | 71.42,49.12 71.42,47.9 70.51,46.99 IC1.4 | 71.42,49.12 71.42,59.33 78.13,66.04 78.13,77.01 77.22,77.93 77.22,81.28 R29.2 | IC6.5 36.83,57.51 37.59,58.27 41.25,58.27 43.08,56.44 v43.08,56.13 43.08,52.63 IC8.14 | IC1.8 66.55,52.17 66.55,56.29 65.48,57.35 65.48,57.81 IC3.4 65.33,57.96 64.26,57.96 IC3.3 64.11,57.96 v64.11,59.64 | IC5.4 50.09,57.96 49.02,57.96 IC5.3 48.87,57.81 v48.87,56.29 | 62.89,45.01 59.69,48.21 SOURCE.1 | 62.89,45.01 64.72,43.18 64.72,38.91 IC7.20 | v47.65,60.86 46.43,62.08 46.43,63.91 IC5.16 | v61.67,62.08 61.67,63.91 IC3.16 | 71.42,49.12 67,49.12 62.89,45.01
  Bottom 0.152: 8.94,38 v15.8,44.86 32.56,44.86 43.08,55.37 v43.08,56.13 45.21,56.13 47.35,58.27 | 8.94,38 8.94,35.56 13.97,30.53 IC4.3 | 8.94,38 IC4.16 | 48.87,59.64 58.01,50.49 58.01,50.04 59.08,48.97 | 48.87,59.64 47.95,60.55 | 47.95,60.55 v47.65,60.86 | 59.08,48.97 59.69,48.36 SOURCE.1 | 48.87,59.64 51.31,62.08 v61.67,62.08 v64.11,59.64 | v48.87,56.29 48.87,56.74 47.35,58.27 | 47.35,58.27 47.35,59.94 47.95,60.55 | 59.08,48.97 48.26,38.15 S2.NO